# Altium schematic sheet BCM_Block_diagram.SchDoc
size A1; SheetNumber: 1; SheetTotal: 13
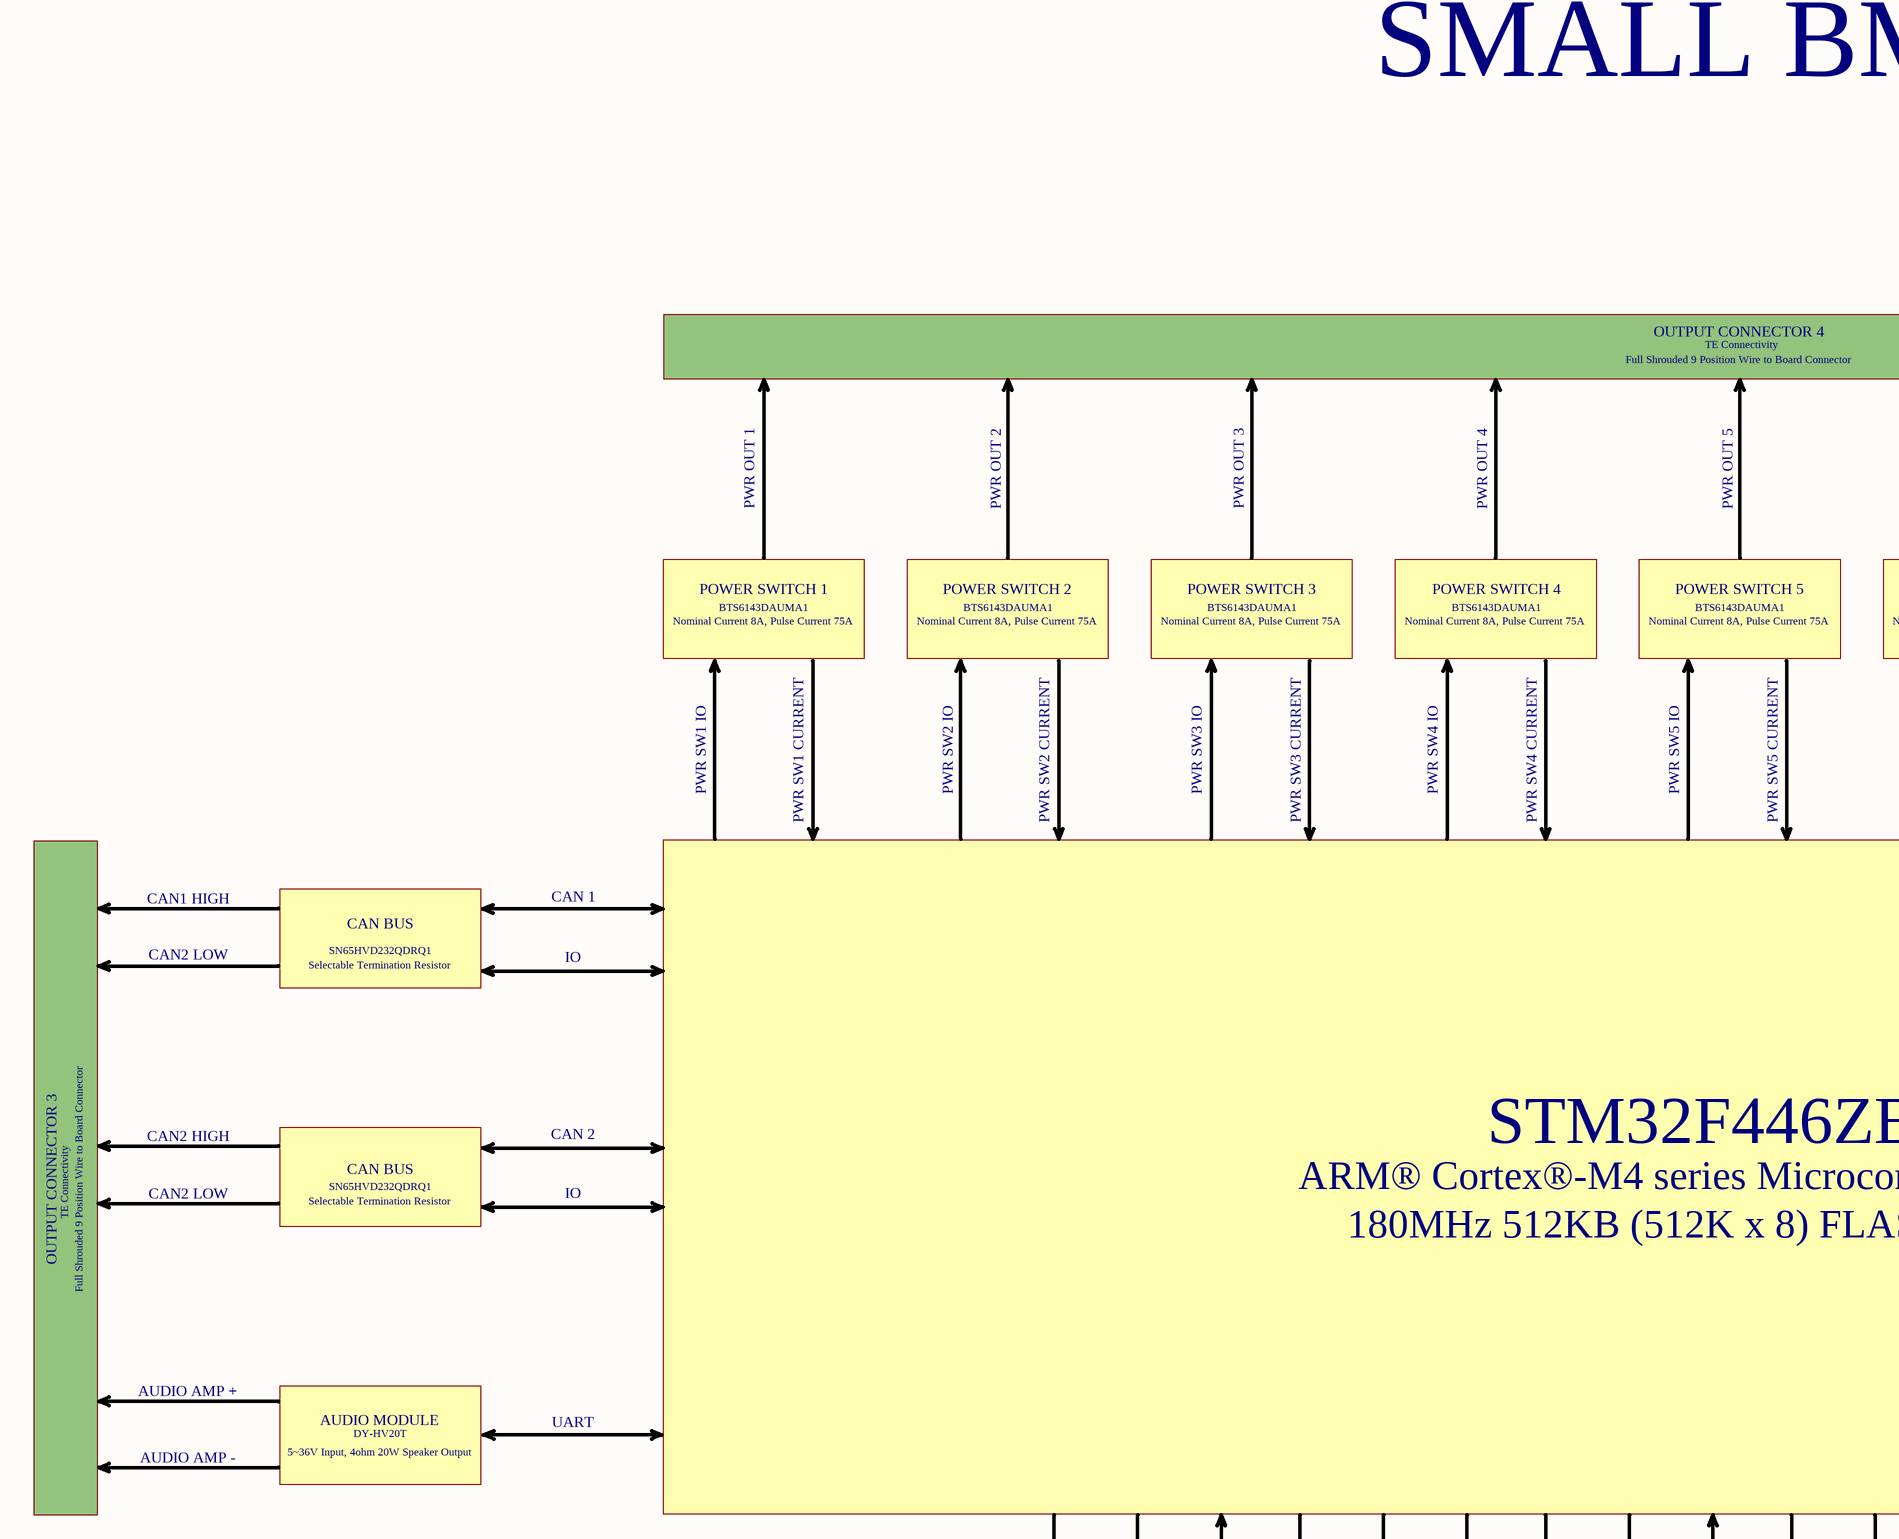
[diagram p0: BCM_Block_diagram.SchDoc, top left]
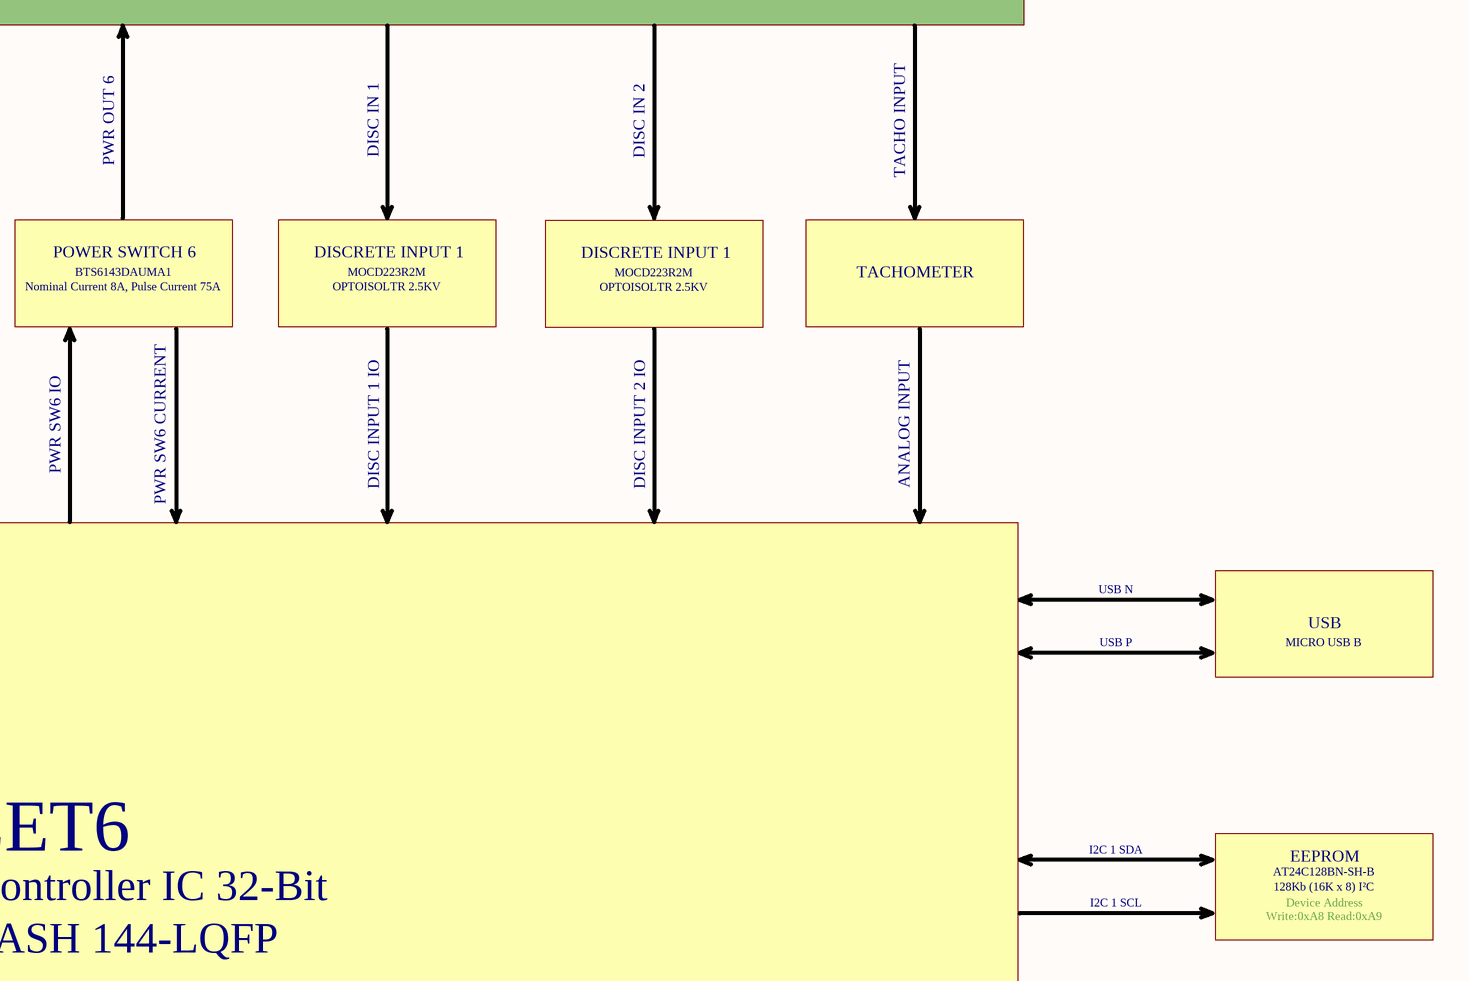
[diagram p1: BCM_Block_diagram.SchDoc, top right]
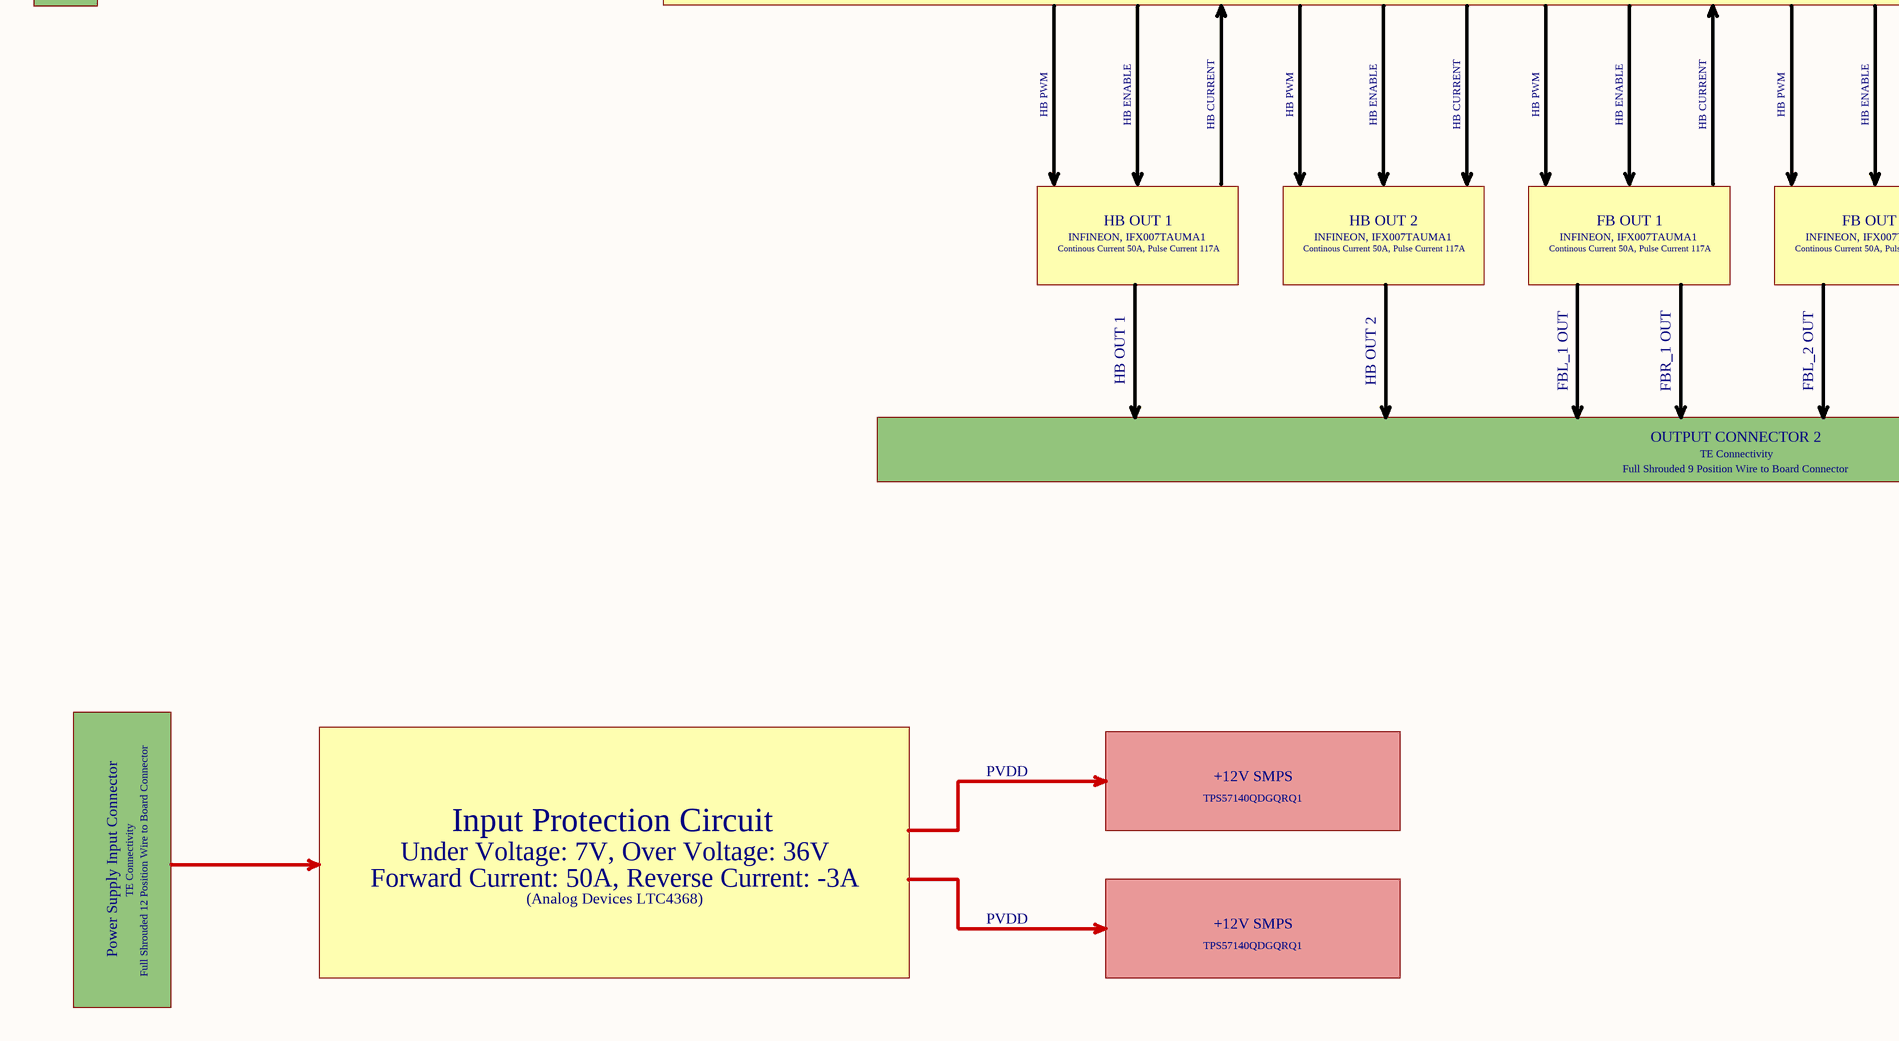
[diagram p2: BCM_Block_diagram.SchDoc, bottom left]
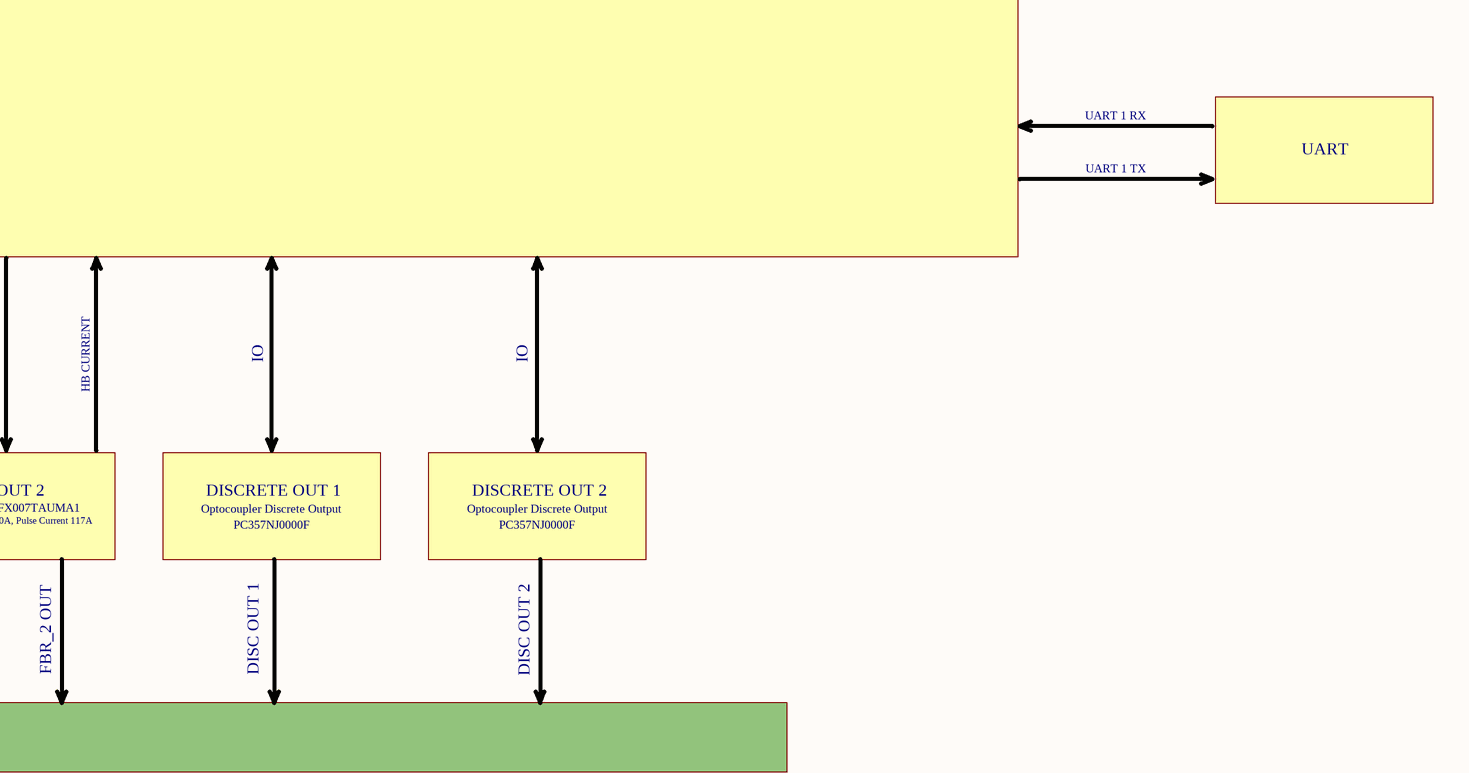
[diagram p3: BCM_Block_diagram.SchDoc, bottom right]

## Notes on the sheet
- SMALL BMC V1.0
- OUTPUT CONNECTOR 4
- Full Shrouded 9 Position Wire to Board Connector
- TE Connectivity
- PWR OUT 1
- PWR OUT 2
- PWR OUT 3
- PWR OUT 4
- PWR OUT 5
- PWR OUT 6
- DISC IN 1
- DISC IN 2
- TACHO INPUT
- POWER SWITCH 1
- POWER SWITCH 2
- POWER SWITCH 3
- POWER SWITCH 4
- POWER SWITCH 5
- POWER SWITCH 6
- DISCRETE INPUT 1
- Nominal Current 8A, Pulse Current 75A
- BTS6143DAUMA1
- OPTOISOLTR 2.5KV
- MOCD223R2M
- TACHOMETER
- PWR SW1 IO
- PWR SW1 CURRENT
- PWR SW2 IO
- PWR SW2 CURRENT
- PWR SW3 IO
- PWR SW3 CURRENT
- PWR SW4 IO
- PWR SW4 CURRENT
- PWR SW5 IO
- PWR SW5 CURRENT
- PWR SW6 IO
- PWR SW6 CURRENT
- DISC INPUT 1 IO
- DISC INPUT 2 IO
- ANALOG INPUT
- CAN1 HIGH
- CAN 1
- USB N
- CAN2 LOW
- Selectable Termination Resistor
- SN65HVD232QDRQ1
- CAN BUS
- IO
- USB P
- MICRO USB B
- USB
- CAN2 HIGH
- CAN 2
- STM32F446ZET6
- I2C 1 SDA
- EEPROM
- ARM® Cortex®-M4 series Microcontroller IC 32-Bit
- I2C 1 SCL
- Write:0xA8 Read:0xA9
- AT24C128BN-SH-B
- 128Kb (16K x 8) I²C
- Device Address
- OUTPUT CONNECTOR 3
- 180MHz 512KB (512K x 8) FLASH 144-LQFP
- AUDIO AMP +
- UART 1 RX
- AUDIO AMP -
- 5~36V Input, 4ohm 20W Speaker Output
- AUDIO MODULE
- DY-HV20T
- UART
- UART 1 TX
- HB PWM
- HB ENABLE
- HB CURRENT
- Continous Current 50A, Pulse Current 117A
- INFINEON, IFX007TAUMA1
- HB OUT 1
- HB OUT 2
- FB OUT 1
- FB OUT 2
- Optocoupler Discrete Output
- DISCRETE OUT 1
- PC357NJ0000F
- DISCRETE OUT 2
- FBL_1 OUT
- FBR_1 OUT
- FBL_2 OUT
- FBR_2 OUT
- DISC OUT 1
- DISC OUT 2
- OUTPUT CONNECTOR 2
- PVDD
- TPS57140QDGQRQ1
- +12V SMPS
- Forward Current: 50A, Reverse Current: -3A
- Under Voltage: 7V, Over Voltage: 36V
- Input Protection Circuit
- Power Supply Input Connector
- (Analog Devices LTC4368)
- Full Shrouded 12 Position Wire to Board Connector
- THIS DOCUMENT AND THE DATA DISCLOSED HEREIN OR
- HEREWITH IS THE PROPERTY OF ALTIUM LIMITED AND MAY
- DWG NO:
- REVISION
- REV:
- DESCRIPTION
- DATE
- APPROVED
- BE FREELY DISTRIBUTED IN WHOLE. NO RIGHTS ARE
- RESERVED OR EXPRESS OR IMPLIED WARANTEE GIVEN.
- ENG:
- APPROVALS
- PROJECT
- DSN:
- CHK:
- REFERENCE DOCUMENTS
- PROJECT REVISION:
- TITLE
- DOCUMENT REVISION:
- DESIGN ITEM:
- BOM:
- FAB DWG:
- PCB DWG:
- ASSY DWG:
- SCALE:
- A3
- SIZE
- CAGE CODE
- FILE NAME
- DWG NO.
- SHEET
- OF
- REV